# Altium schematic sheet 00 Block Diagram.SchDoc
size A3; CheckedBy: TBD; Engineer: Lukas Henkel; Revision: 0.2; SheetNumber: 1; SheetTotal: 3
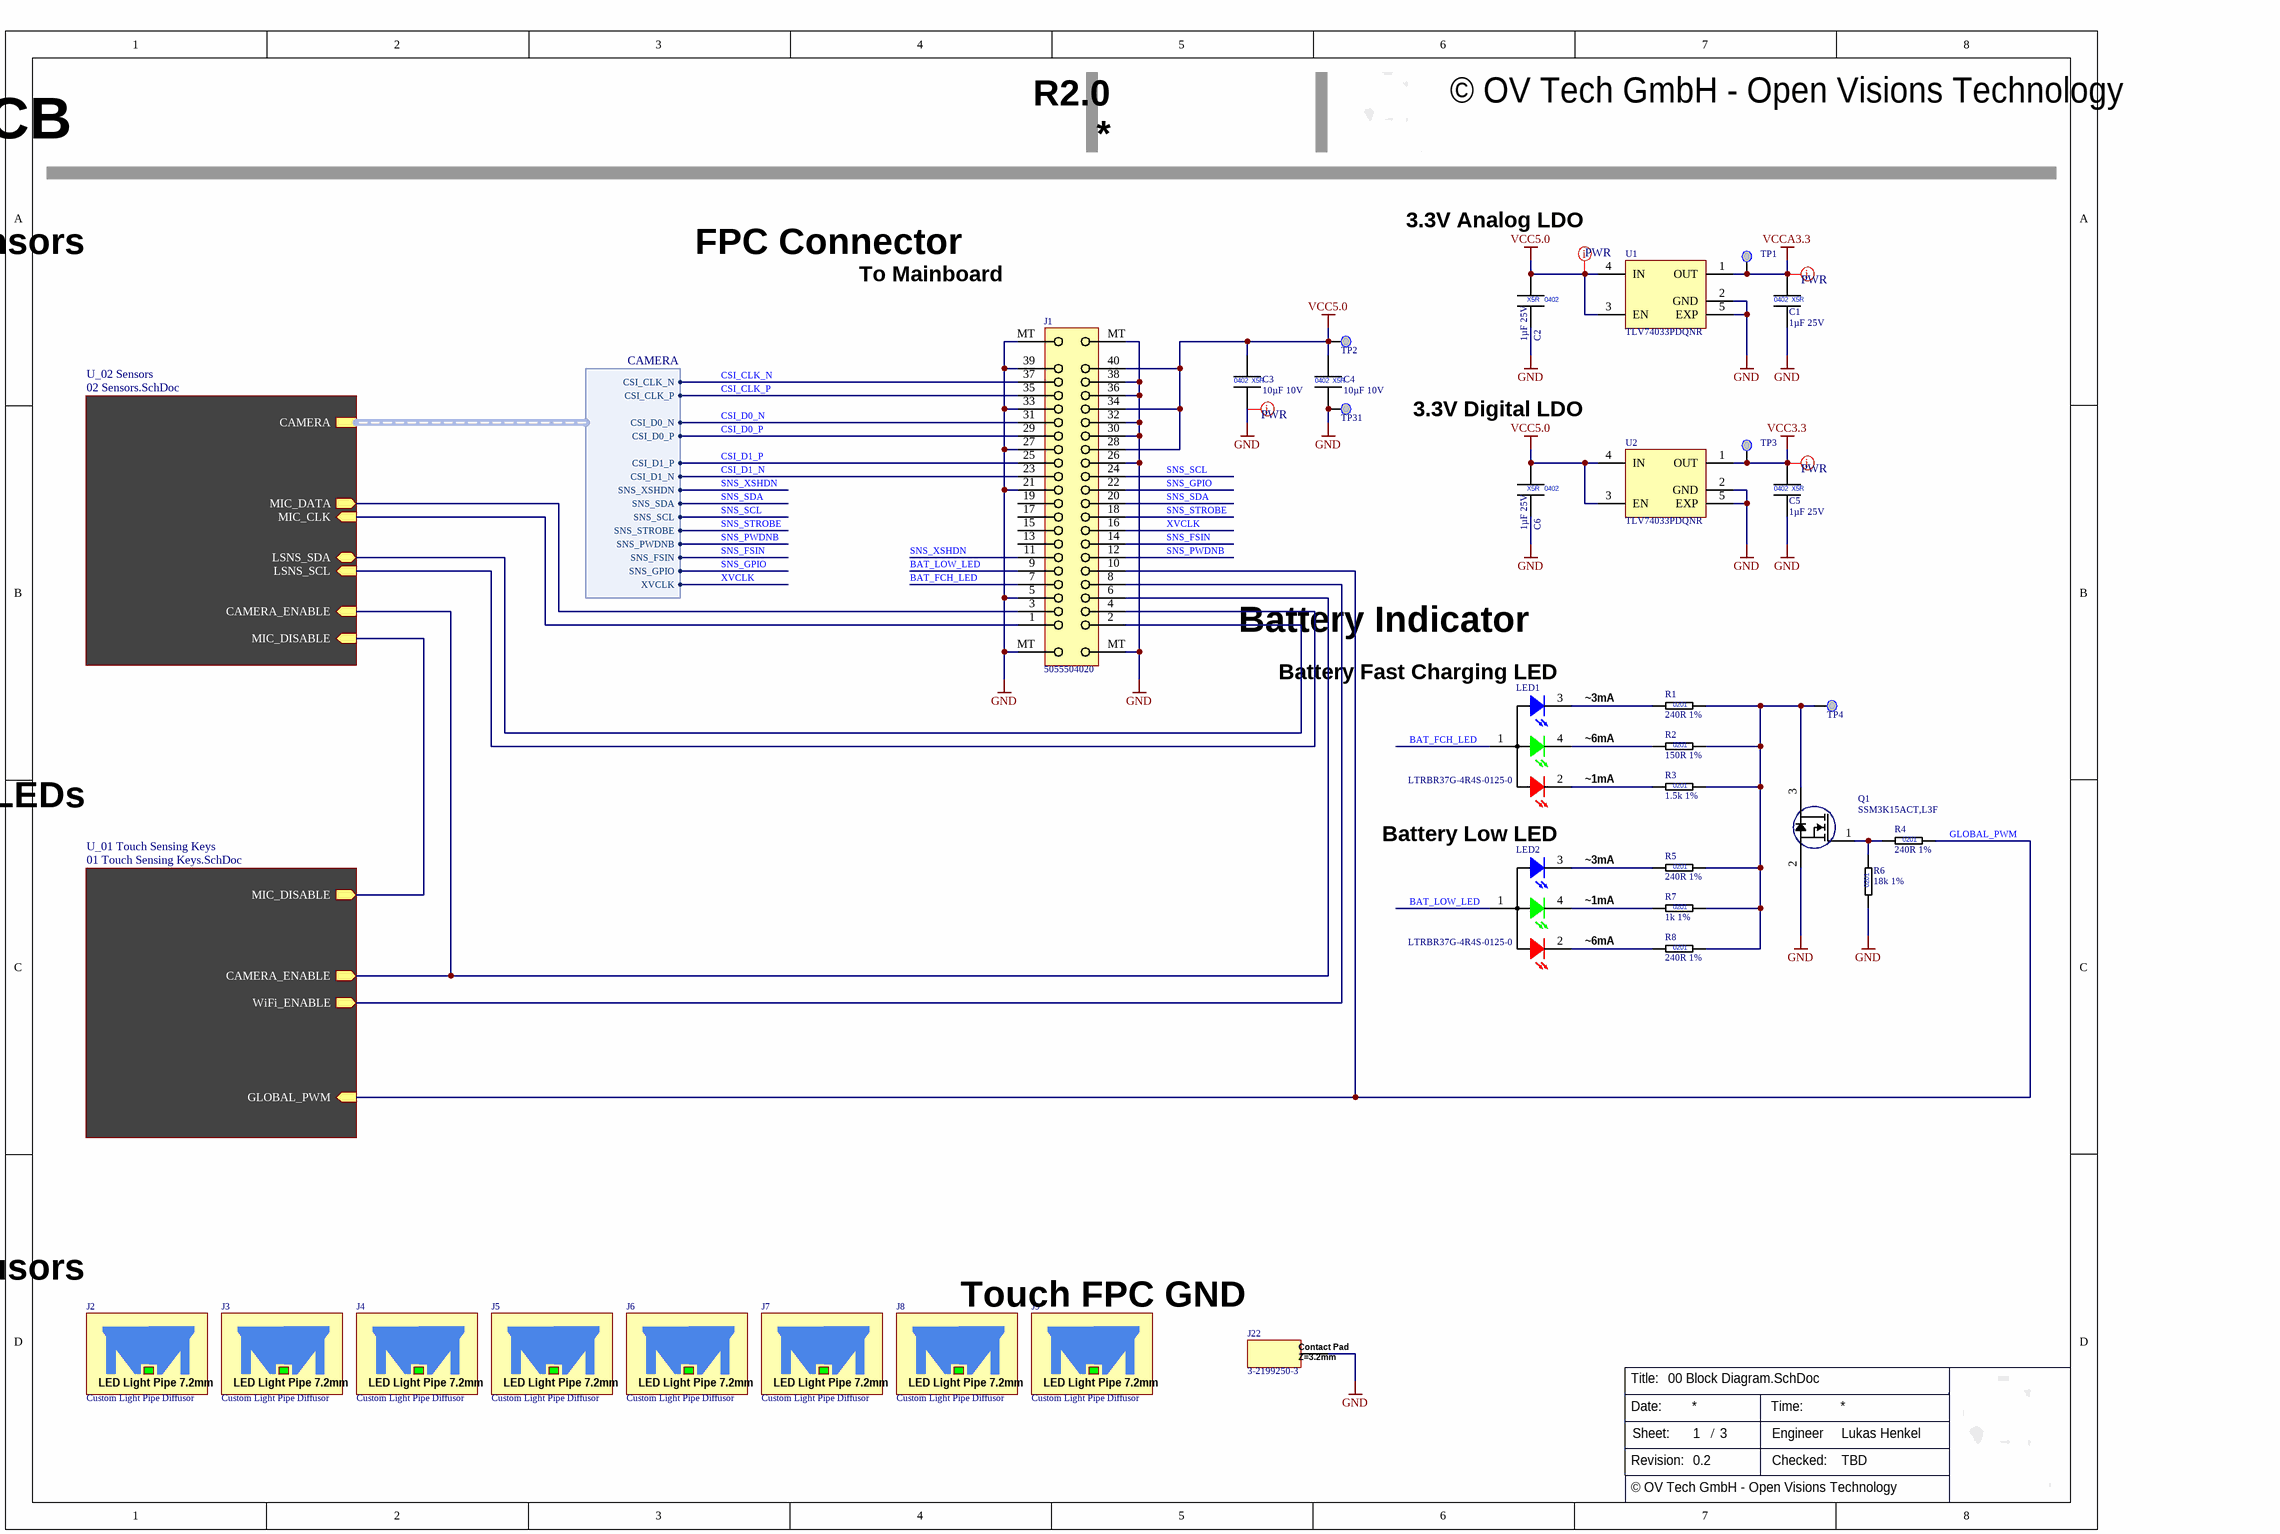
[diagram p0: 00 Block Diagram.SchDoc]

## Parts
C1  1µF 25V  [CAPC1005X06L]
C2  1µF 25V  [CAPC1005X06L]
C3  10µF 10V  [CAPC1005X06L]
C4  10µF 10V  [CAPC1005X06L]
C5  1µF 25V  [CAPC1005X06L]
C6  1µF 25V  [CAPC1005X06L]
J1  5055504020  [BOARD-TO-BOARD 40POL_505550-4020]
J2  Custom Light Pipe Diffusor  [LIGHT_PIPE_DIFFUSOR_CUSTOM]
J3  Custom Light Pipe Diffusor  [LIGHT_PIPE_DIFFUSOR_CUSTOM]
J4  Custom Light Pipe Diffusor  [LIGHT_PIPE_DIFFUSOR_CUSTOM]
J5  Custom Light Pipe Diffusor  [LIGHT_PIPE_DIFFUSOR_CUSTOM]
J6  Custom Light Pipe Diffusor  [LIGHT_PIPE_DIFFUSOR_CUSTOM]
J7  Custom Light Pipe Diffusor  [LIGHT_PIPE_DIFFUSOR_CUSTOM]
J8  Custom Light Pipe Diffusor  [LIGHT_PIPE_DIFFUSOR_CUSTOM]
J9  Custom Light Pipe Diffusor  [LIGHT_PIPE_DIFFUSOR_CUSTOM]
J22  3-2199250-3  [Contact Pad_3.2mm_3-2199250-3]
LED1  LTRBR37G-4R4S-0125-0  [LED 120X120 LTRB R37G RGB]
LED2  LTRBR37G-4R4S-0125-0  [LED 120X120 LTRB R37G RGB]
Q1  SSM3K15ACT,L3F  [DFN65P100X50-3L]
R1  240R 1%  [RESC0603X03L]
R2  150R 1%  [RESC0603X03L]
R3  1.5k 1%  [RESC0603X03L]
R4  240R 1%  [RESC0603X03L]
R5  240R 1%  [RESC0603X03L]
R6  18k 1%  [RESC0603X03L]
R7  1k 1%  [RESC0603X03L]
R8  240R 1%  [RESC0603X03L]
TP1  Testpoint 0.5mm  [TP_0.50mm]  (value not drawn)  (no BOM)
TP2  Testpoint 0.5mm  [TP_0.50mm]  (value not drawn)  (no BOM)
TP3  Testpoint 0.5mm  [TP_0.50mm]  (value not drawn)  (no BOM)
TP4  Testpoint 0.5mm  [TP_0.50mm]  (value not drawn)  (no BOM)
TP31  Testpoint 0.5mm  [TP_0.50mm]  (value not drawn)  (no BOM)
U1  TLV74033PDQNR  [X2SON-DFN]
U2  TLV74033PDQNR  [X2SON-DFN]

## Sub-sheets
U_01 Touch Sensing Keys = 01 Touch Sensing Keys.SchDoc: WiFi_ENABLE (out), MIC_DISABLE (out), GLOBAL_PWM (in), CAMERA_ENABLE (out)
U_02 Sensors = 02 Sensors.SchDoc: MIC_DATA (out), MIC_CLK (in), MIC_DISABLE (in), LSNS_SDA (bidir), LSNS_SCL (in), CAMERA (harness CAMERA), CAMERA_ENABLE (in)

## Harnesses
CAMERA: CSI_D0_N, CSI_D0_P, CSI_D1_N, CSI_D1_P, CSI_CLK_N, CSI_CLK_P, SNS_XSHDN, SNS_SDA, SNS_SCL, SNS_STROBE, SNS_PWDNB, SNS_FSIN, SNS_GPIO, XVCLK

## Nets
GND: C1.2 C2.2 C3.2 C4.2 C5.2 C6.2 J1.5 J1.21 J1.26 J1.27 J1.30 J1.32 J1.33 J1.36 J1.38 J1.39 J1.MT J22.1 Q1.2(S) R6.1 TP31.TP U1.2(GND) U1.5(EXP) U2.2(GND) U2.5(EXP)
VCC3.3: C5.1 TP3.TP U2.1(OUT)
VCC5.0: C2.1 C3.1 C4.1 C6.1 J1.28 J1.34 J1.40 TP2.TP U1.3(EN) U1.4(IN) U2.3(EN) U2.4(IN)
VCCA3.3: C1.1 TP1.TP U1.1(OUT)
BAT_FCH_LED: J1.7 LED1.1
BAT_LOW_LED: J1.9 LED2.1
CSI_CLK_N: J1.37 ; sheet U_02 Sensors/CAMERA.CSI_CLK_N
CSI_CLK_P: J1.35 ; sheet U_02 Sensors/CAMERA.CSI_CLK_P
CSI_D0_N: J1.31 ; sheet U_02 Sensors/CAMERA.CSI_D0_N
CSI_D0_P: J1.29 ; sheet U_02 Sensors/CAMERA.CSI_D0_P
CSI_D1_N: J1.23 ; sheet U_02 Sensors/CAMERA.CSI_D1_N
CSI_D1_P: J1.25 ; sheet U_02 Sensors/CAMERA.CSI_D1_P
GLOBAL_PWM: J1.10 R4.2 ; sheet U_01 Touch Sensing Keys/GLOBAL_PWM
SNS_FSIN: J1.14 ; sheet U_02 Sensors/CAMERA.SNS_FSIN
SNS_GPIO: J1.22 ; sheet U_02 Sensors/CAMERA.SNS_GPIO
SNS_PWDNB: J1.12 ; sheet U_02 Sensors/CAMERA.SNS_PWDNB
SNS_SCL: J1.24 ; sheet U_02 Sensors/CAMERA.SNS_SCL
SNS_SDA: J1.20 ; sheet U_02 Sensors/CAMERA.SNS_SDA
SNS_STROBE: J1.18 ; sheet U_02 Sensors/CAMERA.SNS_STROBE
SNS_XSHDN: J1.11 ; sheet U_02 Sensors/CAMERA.SNS_XSHDN
XVCLK: J1.16 ; sheet U_02 Sensors/CAMERA.XVCLK
NetJ1_1: J1.1 ; sheet U_02 Sensors/MIC_CLK
NetJ1_2: J1.2 ; sheet U_02 Sensors/LSNS_SDA
NetJ1_3: J1.3 ; sheet U_02 Sensors/MIC_DATA
NetJ1_4: J1.4 ; sheet U_02 Sensors/LSNS_SCL
NetJ1_6: J1.6 ; sheet U_01 Touch Sensing Keys/CAMERA_ENABLE, sheet U_02 Sensors/CAMERA_ENABLE
NetJ1_8: J1.8 ; sheet U_01 Touch Sensing Keys/WiFi_ENABLE
NetLED1_2: LED1.2 R3.1
NetLED1_3: LED1.3 R1.1
NetLED1_4: LED1.4 R2.1
NetLED2_2: LED2.2 R8.1
NetLED2_3: LED2.3 R5.1
NetLED2_4: LED2.4 R7.1
NetQ1_1: Q1.1(G) R4.1 R6.2
NetQ1_3: Q1.3(D) R1.2 R2.2 R3.2 R5.2 R7.2 R8.2 TP4.TP
(unnamed): sheet U_01 Touch Sensing Keys/MIC_DISABLE, sheet U_02 Sensors/MIC_DISABLE

Not connected (* = marked no-connect by the designer): J1 13 15 17 19

## Layout directives
net class PWR: GND, VCC3.3, VCC5.0, VCCA3.3

## Notes on the sheet
- R2.0
- Webcam and TouchKey PCB
- © OV Tech GmbH - Open Visions Technology
- 3.3V Analog LDO
- Sensors
- FPC Connector
- To Mainboard
- 3.3V Digital LDO
- Battery Indicator
- Battery Fast Charging LED
- ~3mA
- ~6mA
- Touch Keys w. LEDs
- ~1mA
- Battery Low LED
- LED Diffusors
- (near J22) Touch FPC GND
- Title:
- Date:
- Time:
- Revision:
- Sheet:
- /
- Engineer
- Checked:
- (in symbol CAP_0402_1µ_25V) 0402; X5R
- (in symbol CAP_0402_10µ_10V) 0402; X5R
- (in symbol LIGHT PIPE_CUSTOM_DIFFUSOR) LED Light Pipe 7.2mm
- (in symbol PAD_3-2199250-3) Contact Pad; Z=3.2mm
- (in symbol RES_0201_1.5k_1%) 0201
- (in symbol RES_0201_1k_1%) 0201
- (in symbol RES_0201_18k_1%) 0201
- (in symbol RES_0201_150R_1%) 0201
- (in symbol RES_0201_240R_1%) 0201

## Library data of the parts
C1 C2 C5 C6 = CAP_0402_1µ_25V: Multilayer Ceramic Capacitors MLCC - SMD/SMT 0402 25VDC; Manufacturer 1: Murata Electronics; Manufacturer 1 Prt. Nr.: GRM155R61E105KE11D; Manufacturer 2 Prt. Nr.: 0402X105K250CT; Manufacturer 2: Walsin
C3 C4 = CAP_0402_10µ_10V: Multilayer Ceramic Capacitors MLCC - SMD/SMT 0402 10VDC; Manufacturer 1: Murata Electronics; Manufacturer 1 Prt. Nr.: GRM155R61A475MEAAD; Manufacturer 2 Prt. Nr.: LMK105BBJ475MVLF; Manufacturer 2: Taiyo Yuden
J1 = Board to Board Connector_5055504020: Board to Board connector 40Pol Stacking Header 0.4mm Pitch; Manufacturer 1: Molex; Manufacturer 1 Prt. Nr.: 505550-4020
J2-J9 = LIGHT PIPE_CUSTOM_DIFFUSOR: Low Profile LED light pipe diffusor; Manufacturer 1: OV Tech; Manufacturer 1 Prt. Nr.: Light Pipe 7.2mm
J22 = PAD_3-2199250-3: SMD Contact pad spring loaded 3.2mm; Manufacturer 1: TE Connectivity; Manufacturer 1 Prt. Nr.: 3-2199250-3
LED1 LED2 = LED RGB Low Profile_LTRBR37G-4R4S-0125-0: Micro LED Ultra Low Profile 1.2mm X 1.2mm X 0.25mm LTRBR37G; Manufacturer 1: ams OSRAM; Manufacturer 1 Prt. Nr.: LTRBR37G-4R4S-0125-0
Q1 = N-Channel MOSFET_SSM3K15ACT,L3F: MOSFET 30V SGL N-CH TRENCHMOS Logic Level; Manufacturer 1: Toshiba; Manufacturer 1 Prt. Nr.: SSM3K15ACT,L3F
R1 R4 R5 R8 = RES_0201_240R_1%: Thick Film Resistors - SMD 240 OHM 1%; Manufacturer 1: Yageo; Manufacturer 1 Prt. Nr.: RC0201FR-07240RL; Manufacturer 2 Prt. Nr.: CRCW0201240RFNED; Manufacturer 2: Vishay / Dale
R2 = RES_0201_150R_1%: Thick Film Resistors - SMD 150 OHM 1%; Manufacturer 1: Yageo; Manufacturer 1 Prt. Nr.: RC0201FR-07150RL; Manufacturer 2 Prt. Nr.: CRCW0201150RFNED; Manufacturer 2: Vishay / Dale
R3 = RES_0201_1.5k_1%: Thick Film Resistors - SMD 1.5K OHM 1%; Manufacturer 1: Yageo; Manufacturer 1 Prt. Nr.: RC0201FR-071K5L; Manufacturer 2 Prt. Nr.: CRCW02011K50FNED; Manufacturer 2: Vishay / Dale
R6 = RES_0201_18k_1%: Thick Film Resistors - SMD 18K OHM 1%; Manufacturer 1: Panasonic; Manufacturer 1 Prt. Nr.: ERJ-1GNF1802C; Manufacturer 2 Prt. Nr.: RK73H1HTTC1802F; Manufacturer 2: KOA Speer
R7 = RES_0201_1k_1%: Thick Film Resistors - SMD 1K OHM 1%; Manufacturer 1: Yageo; Manufacturer 1 Prt. Nr.: RC0201FR-071KL; Manufacturer 2 Prt. Nr.: CRCW02011K00FNED; Manufacturer 2: Vishay / Dale
U1 U2 = LDO 3.3V_TLV74033PDQNR: LDO voltage regulator 300mA X2SON; Manufacturer 1: Texas Instruments; Manufacturer 1 Prt. Nr.: TLV74033PDQNR